# EAGLE schematic GD32F470 (EAGLE 9.6.2)
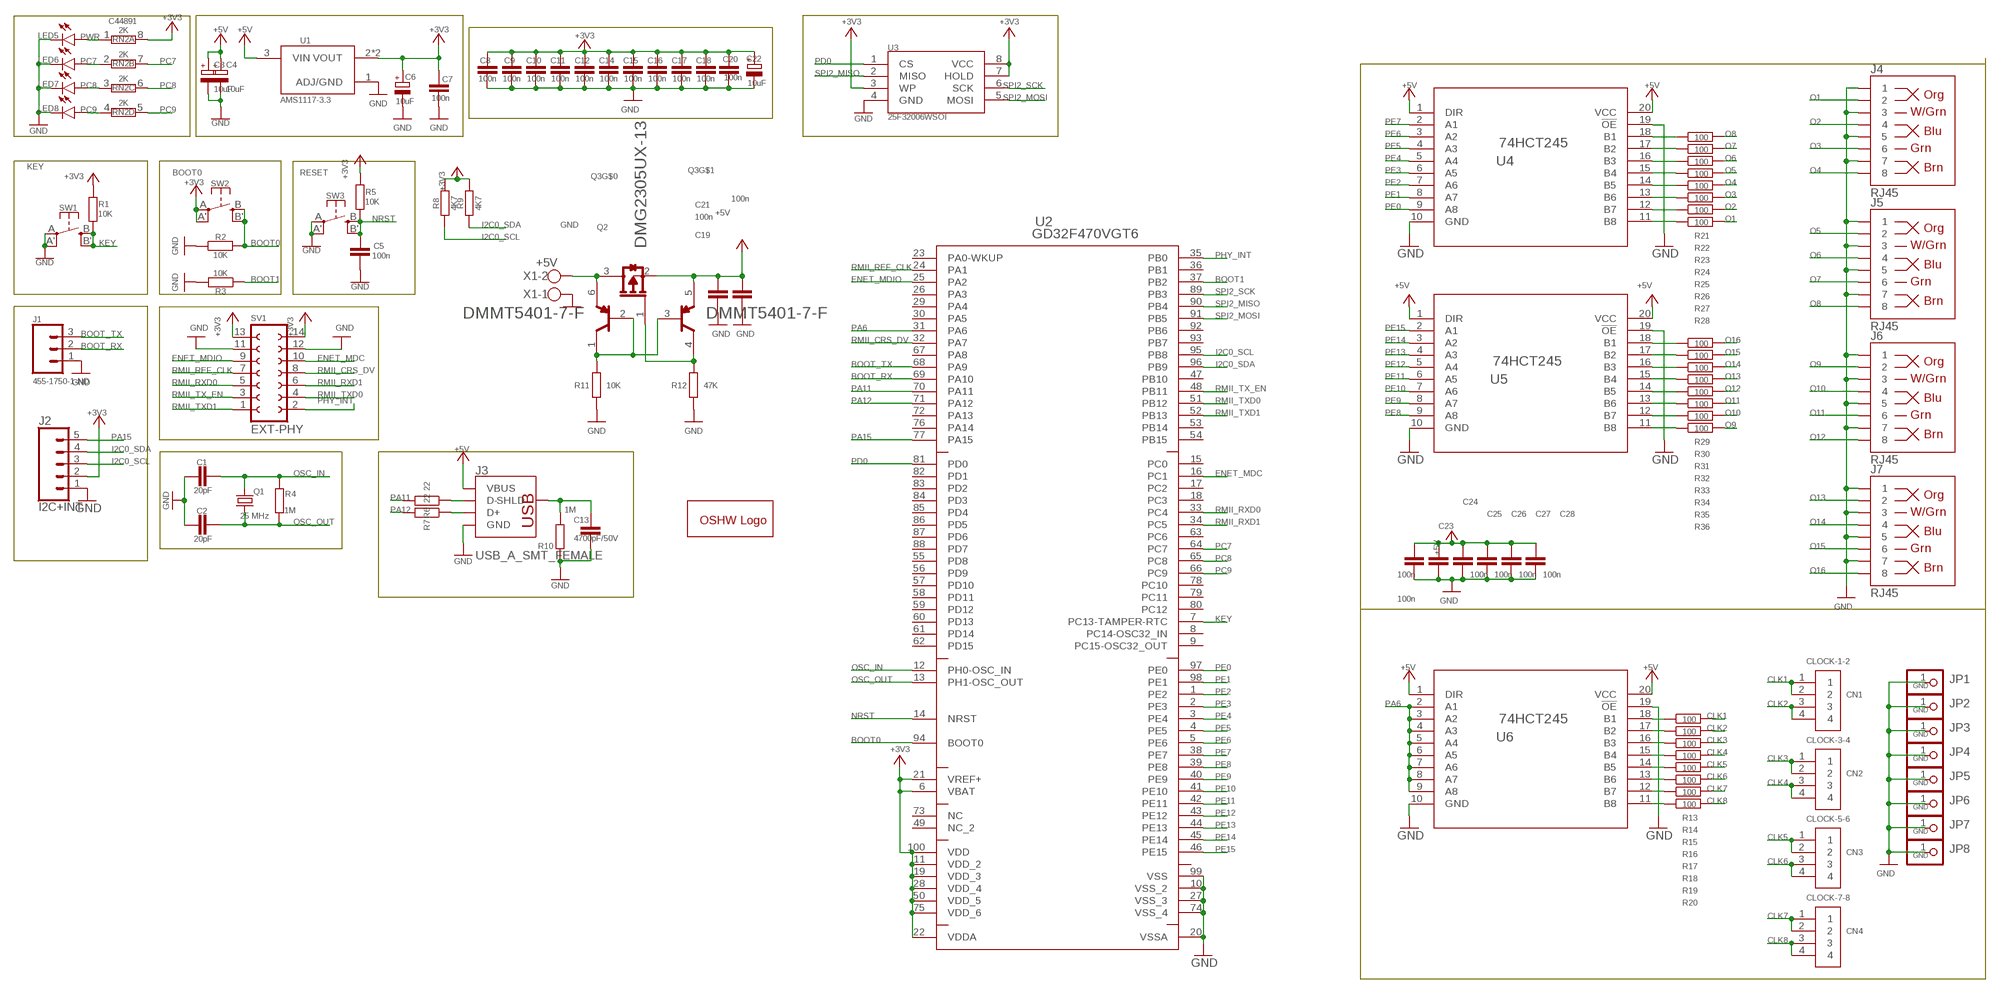
[diagram p0: schematic, sheet 1]

## Parts
C1  20pF  C-EUC0603  [C0603]
C2  20pF  C-EUC0603  [C0603]
C3  10uF  CPOL-EUA/3216-18R  [A/3216-18R]
C4  10uF  CPOL-EUA/3216-18R  [A/3216-18R]
C5  100n  C-EUC0603  [C0603]
C6  10uF  CPOL-EUA/3216-18R  [A/3216-18R]
C7  100n  C-EUC0603  [C0603]
C8  100n  C-EUC0603  [C0603]
C9  100n  C-EUC0603  [C0603]
C10  100n  C-EUC0603  [C0603]
C11  100n  C-EUC0603  [C0603]
C12  100n  C-EUC0603  [C0603]
C13  4700pF/50V  C-EUC0603  [C0603]
C14  100n  C-EUC0603  [C0603]
C15  100n  C-EUC0603  [C0603]
C16  100n  C-EUC0603  [C0603]
C17  100n  C-EUC0603  [C0603]
C18  100n  C-EUC0603  [C0603]
C19  100n  C-EUC0603  [C0603]
C20  100n  C-EUC0603  [C0603]
C21  100n  C-EUC0603  [C0603]
C22  10uF  CPOL-EUA/3216-18R  [A/3216-18R]
C23  100n  C-EUC0603  [C0603]
C24  100n  C-EUC0603  [C0603]
C25  100n  C-EUC0603  [C0603]
C26  100n  C-EUC0603  [C0603]
C27  100n  C-EUC0603  [C0603]
C28  100n  C-EUC0603  [C0603]
CN1  CLOCK-1-2  1X4-CLEANBIG  [1X04-CLEANBIG]
CN2  CLOCK-3-4  1X4-CLEANBIG  [1X04-CLEANBIG]
CN3  CLOCK-5-6  1X4-CLEANBIG  [1X04-CLEANBIG]
CN4  CLOCK-7-8  1X4-CLEANBIG  [1X04-CLEANBIG]
GOLD_ORB_SM1  OSHWLOGOLOGO5MM  [OSHW_5MM]
J1  455-1750-1-ND  CONN_03  [1X03]
J2  I2C+INT  CONN_05PTH  [1X05]
J3  USB_A_SMT_FEMALE  [USB-A]
J4  RJ45  RJ45-8  [RJ45-8]
J5  RJ45  RJ45-8  [RJ45-8]
J6  RJ45  RJ45-8  [RJ45-8]
J7  RJ45  RJ45-8  [RJ45-8]
JP1  GND  PINHD-1X1CB  [1X01-CLEANBIG]
JP2  GND  PINHD-1X1CB  [1X01-CLEANBIG]
JP3  GND  PINHD-1X1CB  [1X01-CLEANBIG]
JP4  GND  PINHD-1X1CB  [1X01-CLEANBIG]
JP5  GND  PINHD-1X1CB  [1X01-CLEANBIG]
JP6  GND  PINHD-1X1CB  [1X01-CLEANBIG]
JP7  GND  PINHD-1X1CB  [1X01-CLEANBIG]
JP8  GND  PINHD-1X1CB  [1X01-CLEANBIG]
LED5  PWR  LEDCHIP-LED0603  [CHIP-LED0603]
LED6  PC7  LEDCHIP-LED0603  [CHIP-LED0603]
LED7  PC8  LEDCHIP-LED0603  [CHIP-LED0603]
LED8  PC9  LEDCHIP-LED0603  [CHIP-LED0603]
Q1  25 MHz  CSM-7X-DU  [CSM-7X-DU]
Q2  DMG2305UX  DIODES_INC._DMG2305UX-13DIODES_INC._DMG2305UX-13_0_0  [DIODES_INC._DMG2305UX-13_0]
Q3  DMMT5401  DIODES_DMMT5401-7-FDIODES_DMMT5401-7-F_0_0  [DIODES_DMMT5401-7-F_0]
R1  10K  R-EU_R0603  [R0603]
R2  10K  R-EU_R0603  [R0603]
R3  10K  R-EU_R0603  [R0603]
R4  1M  R-EU_R0603  [R0603]
R5  10K  R-EU_R0603  [R0603]
R6  22  R-EU_R0402  [R0402]
R7  22  R-EU_R0402  [R0402]
R8  4K7  R-EU_R0402  [R0402]
R9  4K7  R-EU_R0402  [R0402]
R10  1M  R-EU_R0603  [R0603]
R11  10K  R-EU_R0402  [R0402]
R12  47K  R-EU_R0402  [R0402]
R13  100  R-EU_R0402  [R0402]
R14  100  R-EU_R0402  [R0402]
R15  100  R-EU_R0402  [R0402]
R16  100  R-EU_R0402  [R0402]
R17  100  R-EU_R0402  [R0402]
R18  100  R-EU_R0402  [R0402]
R19  100  R-EU_R0402  [R0402]
R20  100  R-EU_R0402  [R0402]
R21  100  R-EU_R0402  [R0402]
R22  100  R-EU_R0402  [R0402]
R23  100  R-EU_R0402  [R0402]
R24  100  R-EU_R0402  [R0402]
R25  100  R-EU_R0402  [R0402]
R26  100  R-EU_R0402  [R0402]
R27  100  R-EU_R0402  [R0402]
R28  100  R-EU_R0402  [R0402]
R29  100  R-EU_R0402  [R0402]
R30  100  R-EU_R0402  [R0402]
R31  100  R-EU_R0402  [R0402]
R32  100  R-EU_R0402  [R0402]
R33  100  R-EU_R0402  [R0402]
R34  100  R-EU_R0402  [R0402]
R35  100  R-EU_R0402  [R0402]
R36  100  R-EU_R0402  [R0402]
RN2  2K  4R-N0402ARV341  [4X0402ARV341]
SV1  EXT-PHY  FE07-2W  [FE07-2W]
SW1  KEY  SPST_TACT-EVQQ2  [EVQ-Q2]
SW2  BOOT0  SPST_TACT-EVQQ2  [EVQ-Q2]
SW3  RESET  SPST_TACT-EVQQ2  [EVQ-Q2]
U1  AMS1117-3.3  [SOT229P700X180-4N]
U2  GD32F470VGT6  GD32F450VET6  [LQFP100]
U3  25F32006WSOI  SPI_FLASH-X25XXSMD1  [SO08-EIAJ]
U4  74HCT245  SN74HCT245PWR  [PW20]
U5  74HCT245  SN74HCT245PWR  [PW20]
U6  74HCT245  SN74HCT245PWR  [PW20]
X1  +5V  W237-102  [W237-102]

## Nets
+3V3: C6.+ C7.1 C8.1 C9.1 C10.1 C11.1 C12.1 C14.1 C15.1 C16.1 C17.1 C18.1 C20.1 C22.+ J2.2 R1.2 R5.2 R8.2 R9.2 RN2.8 SV1.13 SV1.14 SW2.A'(P1) SW2.A(P) U1.2(VOUT) U1.4(VOUT) U2.6(VBAT) U2.11(VDD_2) U2.19(VDD_3) U2.21(VREF+) U2.22(VDDA) U2.28(VDD_4) U2.50(VDD_5) U2.75(VDD_6) U2.100(VDD) U3.3(WP) U3.7(HOLD) U3.8(VCC)
+5V: C3.+ C4.+ C19.1 C21.1 C23.1 C24.1 C25.1 C26.1 C27.1 C28.1 J3.VBUS Q2.2(S) Q3.5(E2) U1.3(VIN) U4.1(DIR) U4.20(VCC) U5.1(DIR) U5.20(VCC) U6.1(DIR) U6.20(VCC)
BOOT0: R2.2 SW2.B'(S1) SW2.B(S) U2.94(BOOT0)
BOOT1: R3.1 U2.37(PB2)
BOOT_RX: J1.2 U2.69(PA10)
BOOT_TX: J1.3 U2.68(PA9)
CLK1: CN1.1 CN1.2 R13.2
CLK2: CN1.3 CN1.4 R14.2
CLK3: CN2.1 CN2.2 R15.2
CLK4: CN2.3 CN2.4 R16.2
CLK5: CN3.1 CN3.2 R17.2
CLK6: CN3.3 CN3.4 R18.2
CLK7: CN4.1 CN4.2 R19.2
CLK8: CN4.3 CN4.4 R20.2
ENET_MDC: SV1.10 U2.16(PC1)
ENET_MDIO: SV1.9 U2.25(PA2)
GND: C1.1 C2.1 C3.- C4.- C5.2 C6.- C7.2 C8.2 C9.2 C10.2 C11.2 C12.2 C13.2 C14.2 C15.2 C16.2 C17.2 C18.2 C19.2 C20.2 C21.2 C22.- C23.2 C24.2 C25.2 C26.2 C27.2 C28.2 J1.1 J2.1 J3.GND J4.1 J4.3 J4.5 J4.7 J5.1 J5.3 J5.5 J5.7 J6.1 J6.3 J6.5 J6.7 J7.1 J7.3 J7.5 J7.7 JP1.1 JP2.1 JP3.1 JP4.1 JP5.1 JP6.1 JP7.1 JP8.1 LED5.C LED6.C LED7.C LED8.C R2.1 R3.2 R10.1 R11.1 R12.1 SV1.11 SV1.12 SW1.A'(P1) SW1.A(P) SW3.A'(P1) SW3.A(P) U1.1(ADJ/GND) U2.10(VSS_2) U2.20(VSSA) U2.27(VSS_3) U2.74(VSS_4) U2.99(VSS) U3.4(GND) U4.10(GND) U4.19(!OE) U5.10(GND) U5.19(!OE) U6.10(GND) U6.19(!OE) X1.1
I2C0_SCL: J2.3 R8.1 U2.95(PB8)
I2C0_SDA: J2.4 R9.1 U2.96(PB9)
KEY: R1.1 SW1.B'(S1) SW1.B(S) U2.7(PC13-TAMPER-RTC)
N$1: R21.1 U4.18(B1)
N$2: Q3.1(C1) Q3.2(B1) Q3.3(B2) R11.2
N$3: R22.1 U4.17(B2)
N$4: R23.1 U4.16(B3)
N$5: R24.1 U4.15(B4)
N$6: R25.1 U4.14(B5)
N$7: R26.1 U4.13(B6)
N$8: R27.1 U4.12(B7)
N$9: R28.1 U4.11(B8)
N$12: R29.1 U5.18(B1)
N$13: R30.1 U5.17(B2)
N$14: R31.1 U5.16(B3)
N$15: R32.1 U5.15(B4)
N$16: R33.1 U5.14(B5)
N$17: R34.1 U5.13(B6)
N$18: R35.1 U5.12(B7)
N$19: R36.1 U5.11(B8)
N$20: J3.D- R6.1
N$21: LED5.A RN2.1
N$22: LED6.A RN2.2
N$23: LED7.A RN2.3
N$24: LED8.A RN2.4
N$30: Q2.1(G) Q3.4(C2) R12.2
N$31: Q2.3(D) Q3.6(E1) X1.2
N$33: R13.1 U6.18(B1)
N$34: R14.1 U6.17(B2)
N$35: R15.1 U6.16(B3)
N$36: R16.1 U6.15(B4)
N$37: R17.1 U6.14(B5)
N$38: R18.1 U6.13(B6)
N$39: R19.1 U6.12(B7)
N$40: R20.1 U6.11(B8)
N$47: J3.D+ R7.1
NRST: C5.1 R5.1 SW3.B'(S1) SW3.B(S) U2.14(NRST)
O1: J4.2 R28.2
O2: J4.4 R27.2
O3: J4.6 R26.2
O4: J4.8 R25.2
O5: J5.2 R24.2
O6: J5.4 R23.2
O7: J5.6 R22.2
O8: J5.8 R21.2
O9: J6.2 R36.2
O10: J6.4 R35.2
O11: J6.6 R34.2
O12: J6.8 R33.2
O13: J7.2 R32.2
O14: J7.4 R31.2
O15: J7.6 R30.2
O16: J7.8 R29.2
OSC_IN: C1.2 Q1.2 R4.1 U2.12(PH0-OSC_IN)
OSC_OUT: C2.2 Q1.1 R4.2 U2.13(PH1-OSC_OUT)
PA6: U2.31(PA6) U6.2(A1) U6.3(A2) U6.4(A3) U6.5(A4) U6.6(A5) U6.7(A6) U6.8(A7) U6.9(A8)
PA11: R6.2 U2.70(PA11)
PA12: R7.2 U2.71(PA12)
PA15: J2.5 U2.77(PA15)
PC7: RN2.7 U2.64(PC7)
PC8: RN2.6 U2.65(PC8)
PC9: RN2.5 U2.66(PC9)
PD0: U2.81(PD0) U3.1(CS)
PE0: U2.97(PE0) U4.9(A8)
PE1: U2.98(PE1) U4.8(A7)
PE2: U2.1(PE2) U4.7(A6)
PE3: U2.2(PE3) U4.6(A5)
PE4: U2.3(PE4) U4.5(A4)
PE5: U2.4(PE5) U4.4(A3)
PE6: U2.5(PE6) U4.3(A2)
PE7: U2.38(PE7) U4.2(A1)
PE8: U2.39(PE8) U5.9(A8)
PE9: U2.40(PE9) U5.8(A7)
PE10: U2.41(PE10) U5.7(A6)
PE11: U2.42(PE11) U5.6(A5)
PE12: U2.43(PE12) U5.5(A4)
PE13: U2.44(PE13) U5.4(A3)
PE14: U2.45(PE14) U5.3(A2)
PE15: U2.46(PE15) U5.2(A1)
PHY_INT: SV1.2 U2.35(PB0)
RMII_CRS_DV: SV1.8 U2.32(PA7)
RMII_REF_CLK: SV1.7 U2.24(PA1)
RMII_RXD0: SV1.5 U2.33(PC4)
RMII_RXD1: SV1.6 U2.34(PC5)
RMII_TX_EN: SV1.3 U2.48(PB11)
RMII_TXD0: SV1.4 U2.51(PB12)
RMII_TXD1: SV1.1 U2.52(PB13)
SHLD: C13.1 J3.SHLD1(SHLD) J3.SHLD2(SHLD) R10.2
SPI2_MISO: U2.90(PB4) U3.2(MISO)
SPI2_MOSI: U2.91(PB5) U3.5(MOSI)
SPI2_SCK: U2.89(PB3) U3.6(SCK)
Unconnected: U2.8(PC14-OSC32_IN) U2.9(PC15-OSC32_OUT) U2.15(PC0) U2.17(PC2) U2.18(PC3) U2.23(PA0-WKUP) U2.26(PA3) U2.29(PA4) U2.30(PA5) U2.36(PB1) U2.47(PB10) U2.49(NC_2) U2.53(PB14) U2.54(PB15) U2.55(PD8) U2.56(PD9) U2.57(PD10) U2.58(PD11) U2.59(PD12) U2.60(PD13) U2.61(PD14) U2.62(PD15) U2.63(PC6) U2.67(PA8) U2.72(PA13) U2.73(NC) U2.76(PA14) U2.78(PC10) U2.79(PC11) U2.80(PC12) U2.82(PD1) U2.83(PD2) U2.84(PD3) U2.85(PD4) U2.86(PD5) U2.87(PD6) U2.88(PD7) U2.92(PB6) U2.93(PB7)

## Library data of the parts
C1 C2 = rcl:C-EU: CAPACITOR, European symbol; JLCPCB: C38523; SPICEPREFIX: C
C3 C4 C6 C22 = rcl:CPOL-EU: POLARIZED CAPACITOR, European symbol; JLCPCB: C7171; SPICEPREFIX: C
C5 C7-C12 C14-C18 C20 C23-C28 = rcl:C-EU: CAPACITOR, European symbol; JLCPCB: C14663; SPICEPREFIX: C
C13 C19 C21 = rcl:C-EU: CAPACITOR, European symbol; SPICEPREFIX: C
CN1-CN4 = adafruit:1X4: 4-pin connector
GOLD_ORB_SM1 = oshw:OSHWLOGO: The OSHW logo for PCB layout
J1 = SparkFun-Connectors:CONN_03: Multi connection point. Often used as Generic Header-pin footprint for 0.1 inch spaced/style header connections On any of the 0.1 inch spaced packages, you can populate with these: Break Away Headers - Straight <https://www.sparkfun.com/products/116> (PRT-00116) Break Away Male Headers - Right Angle <https://www.sparkfun.com/products/553> (PRT-00553) Female Headers <https://www.sparkfun.com/products/115> (PRT-00115) Break Away Headers - Machine Pin <https://www.sparkfun.com/products/117> (PRT-00117) Break Away Female Headers - Swiss Machine Pin <https://www.sparkfun.com/products/743> (PRT-00743) Stackable Header - 3 Pin (Female, 0.1") <https://www.sparkfun.com/products/13875> (PRT-13875) For SCREWTERMINALS and SPRING TERMINALS visit here: Screw Terimnals on SparkFun.com <https://www.sparkfun.com/search/results?term=Screw+Terminals> (5mm/3.5mm/2.54mm spacing) This device is also useful as a general connection point to wire up your design to another part of your project. Our various solder wires solder well into these plated through hole pads. Hook-Up Wire - Assortment (Stranded, 22 AWG) <https://www.sparkfun.com/products/11375> (PRT-11375) Hook-Up Wire - Assortment (Solid Core, 22 AWG) <https://www.sparkfun.com/products/11367> (PRT-11367) View the entire wire category on our website here <https://www.sparkfun.com/categories/141> Special notes: Molex polarized connector foot print use with SKU : PRT-08232 with associated crimp pins and housings.; PROD_ID: XXX-00000
J2 = SparkFun-Connectors:CONN_05: Multi connection point. Often used as Generic Header-pin footprint for 0.1 inch spaced/style header connections On any of the 0.1 inch spaced packages, you can populate with these: Break Away Headers - Straight <https://www.sparkfun.com/products/116> (PRT-00116) Break Away Male Headers - Right Angle <https://www.sparkfun.com/products/553> (PRT-00553) Female Headers <https://www.sparkfun.com/products/115> (PRT-00115) Break Away Headers - Machine Pin <https://www.sparkfun.com/products/117> (PRT-00117) Break Away Female Headers - Swiss Machine Pin <https://www.sparkfun.com/products/743> (PRT-00743) For SCREWTERMINALS and SPRING TERMINALS visit here: Screw Terimnals on SparkFun.com <https://www.sparkfun.com/search/results?term=Screw+Terminals> (5mm/3.5mm/2.54mm spacing) This device is also useful as a general connection point to wire up your design to another part of your project. Our various solder wires solder well into these plated through hole pads. Hook-Up Wire - Assortment (Stranded, 22 AWG) <https://www.sparkfun.com/products/11375> (PRT-11375) Hook-Up Wire - Assortment (Solid Core, 22 AWG) <https://www.sparkfun.com/products/11367> (PRT-11367) View the entire wire category on our website here <https://www.sparkfun.com/categories/141> Special notes: Molex polarized connector foot print use with SKU : PRT-08231 with associated crimp pins and housings. 1MM SMD Version SKU: PRT-10208
J3 = GD32F:USB_A; JLCPCB: C668591
J4-J7 = SparkFun-Connectors:RJ45-8: RJ45 Jack - 8 pin Simple RJ45, 8-pin connection. Commonly used for Cat5, Cat5e, and Cat6 Ethernet cables. Here is the connector we sell at SparkFun: RJ45 8-Pin Connector <https://www.sparkfun.com/products/643> (PRT-00643) Datasheet <https://cdn.sparkfun.com/datasheets/Prototyping/04908.pdf> It is used on this SparkFun product: SparkFun RJ45 Breakout <https://www.sparkfun.com/products/716> (BOB-00716) Note, you may also be interested in the "MAGJACK" version of this. It is basically a RJ45 connector, but also has some status LEDs built into the connector housing. You can check that out in this library at the device named "MAGJACK.dev" and see these products online: RJ45 Ethernet MagJack-Compatible <https://www.sparkfun.com/products/8534> (PRT-08534) SparkFun RJ45 MagJack Breakout <https://www.sparkfun.com/products/13021> (BOB-13021); PROD_ID: CONN-08506; SF_ID: PRT-00643
JP1-JP8 = adafruit:PINHD-1X1: Pin header 1x1 for 0.1" spacing With round pins
LED5-LED8 = led:LED: LED OSRAM: - CHIPLED LG R971, LG N971, LY N971, LG Q971, LY Q971, LO R971, LY R971 LH N974, LH R974 LS Q976, LO Q976, LY Q976 LO Q996 - Hyper CHIPLED LW Q18S LB Q993, LB Q99A, LB R99A - SideLED LS A670, LO A670, LY A670, LG A670, LP A670 LB A673, LV A673, LT A673, LW A673 LH A674 LY A675 LS A676, LA A676, LO A676, LY A676, LW A676 LS A679, LY A679, LG A679 - Hyper Micro SIDELED® LS Y876, LA Y876, LO Y876, LY Y876 LT Y87S - SmartLED LW L88C, LW L88S LB L89C, LB L89S, LG L890 LS L89K, LO L89K, LY L89K LS L896, LA L896, LO L896, LY L896 - TOPLED LS T670, LO T670, LY T670, LG T670, LP T670 LSG T670, LSP T670, LSY T670, LOP T670, LYG T670 LG T671, LOG T671, LSG T671 LB T673, LV T673, LT T673, LW T673 LH T674 LS T676, LA T676, LO T676, LY T676, LB T676, LH T676, LSB T676, LW T676 LB T67C, LV T67C, LT T67C, LS T67K, LO T67K, LY T67K, LW E67C LS E67B, LA E67B, LO E67B, LY E67B, LB E67C, LV E67C, LT E67C LW T67C LS T679, LY T679, LG T679 LS T770, LO T770, LY T770, LG T770, LP T770 LB T773, LV T773, LT T773, LW T773 LH T774 LS E675, LA E675, LY E675, LS T675 LS T776, LA T776, LO T776, LY T776, LB T776 LHGB T686 LT T68C, LB T68C - Hyper Mini TOPLED® LB M676 - Mini TOPLED Santana® LG M470 LS M47K, LO M47K, LY M47K Source: http://www.osram.convergy.de LUXEON: - LUMILED® LXK2-PW12-R00, LXK2-PW12-S00, LXK2-PW14-U00, LXK2-PW14-V00 LXK2-PM12-R00, LXK2-PM12-S00, LXK2-PM14-U00 LXK2-PE12-Q00, LXK2-PE12-R00, LXK2-PE12-S00, LXK2-PE14-T00, LXK2-PE14-U00 LXK2-PB12-K00, LXK2-PB12-L00, LXK2-PB12-M00, LXK2-PB14-N00, LXK2-PB14-P00, LXK2-PB14-Q00 LXK2-PR12-L00, LXK2-PR12-M00, LXK2-PR14-Q00, LXK2-PR14-R00 LXK2-PD12-Q00, LXK2-PD12-R00, LXK2-PD12-S00 LXK2-PH12-R00, LXK2-PH12-S00 LXK2-PL12-P00, LXK2-PL12-Q00, LXK2-PL12-R00 Source: www.luxeon.com KINGBRIGHT: KA-3528ASYC Source: www.kingbright.com
Q1 = crystal:CSM-7X-DU: SMD CRYSTAL Source: www.ecsxtal.com .. Crystal 3.6864MHz CSM_7X_DU.PDF; JLCPCB: C14872; OC_FARNELL: unknown; OC_NEWARK: unknown
Q2 = Diodes Inc. - DMG2305UX-13:DIODES_INC._DMG2305UX-13: P-Channel 20V 4.2A (Ta) 1.4W (Ta) Surface Mount SOT-23; AUTOMOTIVE: No; CENTROID_NOT_SPECIFIED: No; CONTINUOUS_DRAIN_CURRENT: -4.2A; DATASHEET: https://www.diodes.com/assets/Datasheets/DMG2305UX.pdf; DEPLETION_MODE: False; DEVICE_CLASS_L1: Discrete Semiconductors; DEVICE_CLASS_L2: Transistors; DEVICE_CLASS_L3: MOSFETs; DIGIKEY_DESCRIPTION: TRANS MOSFET P-CH 20V 4.2A SOT23; DIGIKEY_PART_NUMBER: DMG2305UX-13DICT-ND; DRAIN_TO_SOURCE_BREAKDOWN_VOLTAGE: -20V; DRAIN_TO_SOURCE_RESISTANCE: 40mΩ; DRAIN_TO_SOURCE_VOLTAGE: -20V; FOOTPRINT_PARAMETERS_1: {"fp_type":"SOT23","params":{"N":{"default":"3","long name":"Number of leads","type":"multichoice","short name":"N"},"A":{"nom":1024999,"long name":"Height","min":903000,"max":1100000,"short name":"A","type":"measurement"},"A1":{"nom":50000,"long name":"Package clearance","min":13000,"max":100000,"short name":"A1","type":"measurement"},"A2":{"nom":975000,"long name":"Package height","min":890000,"max":1000000,"short name":"A2","type":"measurement"},"D":{"nom":2900000,"long name":"Package length","min":2800000,"max":3000000,"short name":"D","type":"measurement"},"E":{"nom":2400000,"long name":"Width /w leads","min":2300000,"max":2500000,"short name":"E","type":"measurement"},"E1":{"nom":1300000,"long name":"Package width","min":1200000,"max":1400000,"short name":"E1","type":"measurement"},"B":{"nom":400000,"long name":"Lead width","min":370000,"max":510000,"short name":"B","type":"measurement"},"C":{"nom":110000,"long name":"Lead thickness","min":85000,"max":150000,"short name":"C","type":"measurement"},"L":{"nom":400000,"long name":"Lead foot length","min":250000,"max":550000,"short name":"L","type":"measurement"},"e":{"nom":915000,"long name":"Lead pitch","min":null,"max":null,"short name":"e","type":"measurement"},"PHI":{"nom":false,"long name":"Lead angle","min":0,"max":8000000,"short name":"PHI","type":"measurement"},"offset x":{"nom":0,"long name":"X Center offset","min":null,"max":null,"short name":"offset x","type":"measurement"},"offset y":{"nom":0,"long name":"Y Center offset","min":null,"max":null,"short name":"offset y","type":"measurement"},"LS":{"default":"Rounded rectangle","long name":"Land shape","type":"multichoice","short name":"LS"},"LS1":{"default":"Rectangle","long name":"Land shape (Pin 1)","type":"multichoice","short name":"LS1"},"solder toe":{"nom":550000,"long name":"Solder fillet (toe)","min":null,"max":null,"short name":"solder toe","type":"fixedmeasurement"},"solder heel":{"nom":450000,"long name":"Solder fillet (heel)","min":null,"max":null,"short name":"solder heel","type":"fixedmeasurement"},"solder side":{"nom":50000,"long name":"Solder fillet (side)","min":null,"max":null,"short name":"solder side","type":"fixedmeasurement"},"courtyard":{"nom":500000,"long name":"Courtyard","min":null,"max":null,"short name":"courtyard","type":"fixedmeasurement"},"SF":{"default":"A","long name":"Packing level","type":"multichoiceparent","short name":"SF","help":"http://support.upverter.com/customer/portal/articles/978783-what-is-a-footprint-packing-level","children":["solder toe","solder heel","solder side","courtyard"]}}}; FOOTPRINT_PARAMETERS_2: {"fp_type":"SOT23","params":{"N":{"default":"3","long name":"Number of leads","type":"multichoice","short name":"N"},"A":{"nom":1024999,"long name":"Height","min":903000,"max":1100000,"short name":"A","type":"measurement"},"A1":{"nom":50000,"long name":"Package clearance","min":13000,"max":100000,"short name":"A1","type":"measurement"},"A2":{"nom":975000,"long name":"Package height","min":890000,"max":1000000,"short name":"A2","type":"measurement"},"D":{"nom":2900000,"long name":"Package length","min":2800000,"max":3000000,"short name":"D","type":"measurement"},"E":{"nom":2400000,"long name":"Width /w leads","min":2300000,"max":2500000,"short name":"E","type":"measurement"},"E1":{"nom":1300000,"long name":"Package width","min":1200000,"max":1400000,"short name":"E1","type":"measurement"},"B":{"nom":400000,"long name":"Lead width","min":370000,"max":510000,"short name":"B","type":"measurement"},"C":{"nom":110000,"long name":"Lead thickness","min":85000,"max":150000,"short name":"C","type":"measurement"},"L":{"nom":400000,"long name":"Lead foot length","min":250000,"max":550000,"short name":"L","type":"measurement"},"e":{"nom":915000,"long name":"Lead pitch","min":null,"max":null,"short name":"e","type":"measurement"},"PHI":{"nom":false,"long name":"Lead angle","min":0,"max":8000000,"short name":"PHI","type":"measurement"},"offset x":{"nom":0,"long name":"X Center offset","min":null,"max":null,"short name":"offset x","type":"measurement"},"offset y":{"nom":0,"long name":"Y Center offset","min":null,"max":null,"short name":"offset y","type":"measurement"},"LS":{"default":"Rounded rectangle","long name":"Land shape","type":"multichoice","short name":"LS"},"LS1":{"default":"Rectangle","long name":"Land shape (Pin 1)","type":"multichoice","short name":"LS1"},"solder toe":{"nom":350000,"long name":"Solder fillet (toe)","min":null,"max":null,"short name":"solder toe","type":"fixedmeasurement"},"solder heel":{"nom":350000,"long name":"Solder fillet (heel)","min":null,"max":null,"short name":"solder heel","type":"fixedmeasurement"},"solder side":{"nom":30000,"long name":"Solder fillet (side)","min":null,"max":null,"short name":"solder side","type":"fixedmeasurement"},"courtyard":{"nom":250000,"long name":"Courtyard","min":null,"max":null,"short name":"courtyard","type":"fixedmeasurement"},"SF":{"default":"B","long name":"Packing level","type":"multichoiceparent","short name":"SF","help":"http://support.upverter.com/customer/portal/articles/978783-what-is-a-footprint-packing-level","children":["solder toe","solder heel","solder side","courtyard"]}}}; FOOTPRINT_PARAMETERS_3: {"fp_type":"SOT23","params":{"N":{"default":"3","long name":"Number of leads","type":"multichoice","short name":"N"},"A":{"nom":1024999,"long name":"Height","min":903000,"max":1100000,"short name":"A","type":"measurement"},"A1":{"nom":50000,"long name":"Package clearance","min":13000,"max":100000,"short name":"A1","type":"measurement"},"A2":{"nom":975000,"long name":"Package height","min":890000,"max":1000000,"short name":"A2","type":"measurement"},"D":{"nom":2900000,"long name":"Package length","min":2800000,"max":3000000,"short name":"D","type":"measurement"},"E":{"nom":2400000,"long name":"Width /w leads","min":2300000,"max":2500000,"short name":"E","type":"measurement"},"E1":{"nom":1300000,"long name":"Package width","min":1200000,"max":1400000,"short name":"E1","type":"measurement"},"B":{"nom":400000,"long name":"Lead width","min":370000,"max":510000,"short name":"B","type":"measurement"},"C":{"nom":110000,"long name":"Lead thickness","min":85000,"max":150000,"short name":"C","type":"measurement"},"L":{"nom":400000,"long name":"Lead foot length","min":250000,"max":550000,"short name":"L","type":"measurement"},"e":{"nom":915000,"long name":"Lead pitch","min":null,"max":null,"short name":"e","type":"measurement"},"PHI":{"nom":false,"long name":"Lead angle","min":0,"max":8000000,"short name":"PHI","type":"measurement"},"offset x":{"nom":0,"long name":"X Center offset","min":null,"max":null,"short name":"offset x","type":"measurement"},"offset y":{"nom":0,"long name":"Y Center offset","min":null,"max":null,"short name":"offset y","type":"measurement"},"LS":{"default":"Rounded rectangle","long name":"Land shape","type":"multichoice","short name":"LS"},"LS1":{"default":"Rectangle","long name":"Land shape (Pin 1)","type":"multichoice","short name":"LS1"},"solder toe":{"nom":150000,"long name":"Solder fillet (toe)","min":null,"max":null,"short name":"solder toe","type":"fixedmeasurement"},"solder heel":{"nom":250000,"long name":"Solder fillet (heel)","min":null,"max":null,"short name":"solder heel","type":"fixedmeasurement"},"solder side":{"nom":10000,"long name":"Solder fillet (side)","min":null,"max":null,"short name":"solder side","type":"fixedmeasurement"},"courtyard":{"nom":100000,"long name":"Courtyard","min":null,"max":null,"short name":"courtyard","type":"fixedmeasurement"},"SF":{"default":"C","long name":"Packing level","type":"multichoiceparent","short name":"SF","help":"http://support.upverter.com/customer/portal/articles/978783-what-is-a-footprint-packing-level","children":["solder toe","solder heel","solder side","courtyard"]}}}; FOOTPRINT_URL: https://www.diodes.com/assets/Package-Files/SOT23.pdf; FOOTPRINT_VARIANT_NAME_0: Recommended_Land_Pattern; FOOTPRINT_VARIANT_NAME_1: IPC_A; FOOTPRINT_VARIANT_NAME_2: IPC_B; FOOTPRINT_VARIANT_NAME_3: IPC_C; GATE_CHARGE_AT_VGS: 10.2nC @ -4.5V; GATE_TO_SOURCE_VOLTAGE: 8V; HEIGHT: 1.1mm; INPUT_CAPACITACE_AT_VDS: 808pF @ -15V; IPC_LAND_PATTERN_NAME: SOT92P240X102-3; LEAD_FREE: Yes; MAX_JUNCTION_TEMP: +150°C; MF: Diodes Inc.; MFG_PACKAGE_IDENT: SOT23; MFG_PACKAGE_IDENT_DATE: 01/2017; MFG_PACKAGE_IDENT_REV: 0; MOUSER_DESCRIPTION: MOSFET P-Ch ENH FET -20V 52mOhm -5.0V; MOUSER_PART_NUMBER: 621-DMG2305UX-13; MPN: DMG2305UX-13; NUMBER_OF_CHANNELS: 1; NUMBER_OF_P_CHANNELS: 1; PACKAGE: SOT23; POWER_DISSIPATION: 1.4W; PREFIX: Q; PULSE_DRAIN_CURRENT: -15A; ROHS: Yes; RTHJA_MAX: 90°C/W; STANDOFF_HEIGHT: 0.013mm; TEMPERATURE_RANGE_HIGH: +150°C; TEMPERATURE_RANGE_LOW: -55°C; THRESHOLD_VGS_MAX: -0.9V; THRESHOLD_VGS_MIN: -0.5V; TURN_OFF_DELAY_TIME: 79.3ns; TURN_ON_DELAY_TIME: 10.8ns; VERIFICATION_VERSION: 0.0.0.3
Q3 = Diodes - DMMT5401-7-F:DIODES_DMMT5401-7-F: Bipolar (BJT) Transistor Array 2 PNP (Dual) Matched Pair 150V 200mA 300MHz 300mW Surface Mount SOT-26; AUTOMOTIVE: Yes; AUTOMOTIVE_GRADE: Grade 0; CENTROID_NOT_SPECIFIED: No; CIIVA_IDS: 854262; COLLECTOR_BASE_VOLTAGE: -160V; COLLECTOR_EMITTER_BREAKDOWN_VOLTAGE: -150V; COLLECTOR_EMITTER_SATURATION_VOLTAGE: -0.5V; COLLECTOR_EMITTER_VOLTAGE: -150V; DATASHEET: https://www.diodes.com/assets/Datasheets/ds30437.pdf; DEVICE_CLASS_L1: Discrete Semiconductors; DEVICE_CLASS_L2: Transistors; DEVICE_CLASS_L3: BJTs; DIGIKEY_DESCRIPTION: TRANS 2PNP 150V 0.2A SOT26; DIGIKEY_PART_NUMBER: DMMT5401-FDICT-ND; EMITTER_BASE_VOLTAGE: -5V; FOOTPRINT_PARAMETERS_1: {"fp_type":"SOT23","params":{"N":{"default":"6","long name":"Number of leads","type":"multichoice","short name":"N"},"A":{"nom":1150000,"long name":"Height","min":1012999,"max":1400000,"short name":"A","type":"measurement"},"A1":{"nom":50000,"long name":"Package clearance","min":13000,"max":100000,"short name":"A1","type":"measurement"},"A2":{"nom":1100000,"long name":"Package height","min":1000000,"max":1300000,"short name":"A2","type":"measurement"},"D":{"nom":3000000,"long name":"Package length","min":2900000,"max":3100000,"short name":"D","type":"measurement"},"E":{"nom":2800000,"long name":"Width /w leads","min":2700000,"max":3000000,"short name":"E","type":"measurement"},"E1":{"nom":1600000,"long name":"Package width","min":1500000,"max":1700000,"short name":"E1","type":"measurement"},"B":{"nom":380000,"long name":"Lead width","min":350000,"max":500000,"short name":"B","type":"measurement"},"C":{"nom":150000,"long name":"Lead thickness","min":100000,"max":200000,"short name":"C","type":"measurement"},"L":{"nom":400000,"long name":"Lead foot length","min":350000,"max":550000,"short name":"L","type":"measurement"},"e":{"nom":950000,"long name":"Lead pitch","min":null,"max":null,"short name":"e","type":"measurement"},"PHI":{"nom":false,"long name":"Lead angle","min":0,"max":8000000,"short name":"PHI","type":"measurement"},"offset x":{"nom":0,"long name":"X Center offset","min":null,"max":null,"short name":"offset x","type":"measurement"},"offset y":{"nom":0,"long name":"Y Center offset","min":null,"max":null,"short name":"offset y","type":"measurement"},"LS":{"default":"Rounded rectangle","long name":"Land shape","type":"multichoice","short name":"LS"},"LS1":{"default":"Rectangle","long name":"Land shape (Pin 1)","type":"multichoice","short name":"LS1"},"solder toe":{"nom":550000,"long name":"Solder fillet (toe)","min":null,"max":null,"short name":"solder toe","type":"fixedmeasurement"},"solder heel":{"nom":450000,"long name":"Solder fillet (heel)","min":null,"max":null,"short name":"solder heel","type":"fixedmeasurement"},"solder side":{"nom":50000,"long name":"Solder fillet (side)","min":null,"max":null,"short name":"solder side","type":"fixedmeasurement"},"courtyard":{"nom":500000,"long name":"Courtyard","min":null,"max":null,"short name":"courtyard","type":"fixedmeasurement"},"SF":{"default":"A","long name":"Packing level","type":"multichoiceparent","short name":"SF","help":"http://support.upverter.com/customer/portal/articles/978783-what-is-a-footprint-packing-level","children":["solder toe","solder heel","solder side","courtyard"]}}}; FOOTPRINT_PARAMETERS_2: {"fp_type":"SOT23","params":{"N":{"default":"6","long name":"Number of leads","type":"multichoice","short name":"N"},"A":{"nom":1150000,"long name":"Height","min":1012999,"max":1400000,"short name":"A","type":"measurement"},"A1":{"nom":50000,"long name":"Package clearance","min":13000,"max":100000,"short name":"A1","type":"measurement"},"A2":{"nom":1100000,"long name":"Package height","min":1000000,"max":1300000,"short name":"A2","type":"measurement"},"D":{"nom":3000000,"long name":"Package length","min":2900000,"max":3100000,"short name":"D","type":"measurement"},"E":{"nom":2800000,"long name":"Width /w leads","min":2700000,"max":3000000,"short name":"E","type":"measurement"},"E1":{"nom":1600000,"long name":"Package width","min":1500000,"max":1700000,"short name":"E1","type":"measurement"},"B":{"nom":380000,"long name":"Lead width","min":350000,"max":500000,"short name":"B","type":"measurement"},"C":{"nom":150000,"long name":"Lead thickness","min":100000,"max":200000,"short name":"C","type":"measurement"},"L":{"nom":400000,"long name":"Lead foot length","min":350000,"max":550000,"short name":"L","type":"measurement"},"e":{"nom":950000,"long name":"Lead pitch","min":null,"max":null,"short name":"e","type":"measurement"},"PHI":{"nom":false,"long name":"Lead angle","min":0,"max":8000000,"short name":"PHI","type":"measurement"},"offset x":{"nom":0,"long name":"X Center offset","min":null,"max":null,"short name":"offset x","type":"measurement"},"offset y":{"nom":0,"long name":"Y Center offset","min":null,"max":null,"short name":"offset y","type":"measurement"},"LS":{"default":"Rounded rectangle","long name":"Land shape","type":"multichoice","short name":"LS"},"LS1":{"default":"Rectangle","long name":"Land shape (Pin 1)","type":"multichoice","short name":"LS1"},"solder toe":{"nom":350000,"long name":"Solder fillet (toe)","min":null,"max":null,"short name":"solder toe","type":"fixedmeasurement"},"solder heel":{"nom":350000,"long name":"Solder fillet (heel)","min":null,"max":null,"short name":"solder heel","type":"fixedmeasurement"},"solder side":{"nom":30000,"long name":"Solder fillet (side)","min":null,"max":null,"short name":"solder side","type":"fixedmeasurement"},"courtyard":{"nom":250000,"long name":"Courtyard","min":null,"max":null,"short name":"courtyard","type":"fixedmeasurement"},"SF":{"default":"B","long name":"Packing level","type":"multichoiceparent","short name":"SF","help":"http://support.upverter.com/customer/portal/articles/978783-what-is-a-footprint-packing-level","children":["solder toe","solder heel","solder side","courtyard"]}}}; FOOTPRINT_PARAMETERS_3: {"fp_type":"SOT23","params":{"N":{"default":"6","long name":"Number of leads","type":"multichoice","short name":"N"},"A":{"nom":1150000,"long name":"Height","min":1012999,"max":1400000,"short name":"A","type":"measurement"},"A1":{"nom":50000,"long name":"Package clearance","min":13000,"max":100000,"short name":"A1","type":"measurement"},"A2":{"nom":1100000,"long name":"Package height","min":1000000,"max":1300000,"short name":"A2","type":"measurement"},"D":{"nom":3000000,"long name":"Package length","min":2900000,"max":3100000,"short name":"D","type":"measurement"},"E":{"nom":2800000,"long name":"Width /w leads","min":2700000,"max":3000000,"short name":"E","type":"measurement"},"E1":{"nom":1600000,"long name":"Package width","min":1500000,"max":1700000,"short name":"E1","type":"measurement"},"B":{"nom":380000,"long name":"Lead width","min":350000,"max":500000,"short name":"B","type":"measurement"},"C":{"nom":150000,"long name":"Lead thickness","min":100000,"max":200000,"short name":"C","type":"measurement"},"L":{"nom":400000,"long name":"Lead foot length","min":350000,"max":550000,"short name":"L","type":"measurement"},"e":{"nom":950000,"long name":"Lead pitch","min":null,"max":null,"short name":"e","type":"measurement"},"PHI":{"nom":false,"long name":"Lead angle","min":0,"max":8000000,"short name":"PHI","type":"measurement"},"offset x":{"nom":0,"long name":"X Center offset","min":null,"max":null,"short name":"offset x","type":"measurement"},"offset y":{"nom":0,"long name":"Y Center offset","min":null,"max":null,"short name":"offset y","type":"measurement"},"LS":{"default":"Rounded rectangle","long name":"Land shape","type":"multichoice","short name":"LS"},"LS1":{"default":"Rectangle","long name":"Land shape (Pin 1)","type":"multichoice","short name":"LS1"},"solder toe":{"nom":150000,"long name":"Solder fillet (toe)","min":null,"max":null,"short name":"solder toe","type":"fixedmeasurement"},"solder heel":{"nom":250000,"long name":"Solder fillet (heel)","min":null,"max":null,"short name":"solder heel","type":"fixedmeasurement"},"solder side":{"nom":10000,"long name":"Solder fillet (side)","min":null,"max":null,"short name":"solder side","type":"fixedmeasurement"},"courtyard":{"nom":100000,"long name":"Courtyard","min":null,"max":null,"short name":"courtyard","type":"fixedmeasurement"},"SF":{"default":"C","long name":"Packing level","type":"multichoiceparent","short name":"SF","help":"http://support.upverter.com/customer/portal/articles/978783-what-is-a-footprint-packing-level","children":["solder toe","solder heel","solder side","courtyard"]}}}; FOOTPRINT_URL: https://www.diodes.com/assets/Package-Files/SOT26-SC74R.pdf; FOOTPRINT_VARIANT_NAME_0: Recommended_Land_Pattern; FOOTPRINT_VARIANT_NAME_1: IPC_A; FOOTPRINT_VARIANT_NAME_2: IPC_B; FOOTPRINT_VARIANT_NAME_3: IPC_C; GAIN_BANDWIDTH_PRODUCT: 100MHz; HEIGHT: 1.4mm; HFE_MAX: 240; HFE_MIN: 60; HFE_SS_MAX: 260; HFE_SS_MIN: 40; HFE_SS_TESTIC: -1mA; HFE_SS_TESTVCE: -10V; HFE_TESTIC: -10mA; HFE_TESTVCE: -5V; IMPORTED_FROM: vault; IMPORT_TS: 1521857859; LEAD_FREE: Yes; MAX_COLLECTOR_CURRENT: -200mA; MAX_JUNCTION_TEMP: +150°C; MF: Diodes; MFG_PACKAGE_IDENT: SOT26 (SC74R); MFG_PACKAGE_IDENT_COMPONENT_ID: 5f0f242ef940d63b; MFG_PACKAGE_IDENT_DATE: 03/2017; MFG_PACKAGE_IDENT_REV: 0; MOUSER_DESCRIPTION: Bipolar Transistors - BJT MATCHED PNP SM SIGNAL TRANS; MOUSER_PART_NUMBER: 621-DMMT5401-7-F; MPN: DMMT5401-7-F; NUMBER_OF_ELEMENTS: 2; NUMBER_OF_PNP: 2; PACKAGE: SOT-26-6; POWER_DISSIPATION: 300mW; PREFIX: Q; RELEASE_DATE: 1475030218; RESISTANCE: 56.2 kohm; ROHS: Yes; RTHJA_MAX: 417°C/W; STANDOFF_HEIGHT: 0.013mm; TEMPERATURE_RANGE_HIGH: +150°C; TEMPERATURE_RANGE_LOW: -55°C; VAULT_GUID: AAD9F767-3884-4A64-86E0-FF641185CA98; VERIFICATION_VERSION: 0.0.0.3
R1-R3 R5 = rcl:R-EU_: RESISTOR, European symbol; JLCPCB: C25804; SPICEPREFIX: R
R4 = rcl:R-EU_: RESISTOR, European symbol; JLCPCB: C22935; SPICEPREFIX: R
R6 R7 R11-R36 = rcl:R-EU_: RESISTOR, European symbol; SPICEPREFIX: R
R8 R9 = rcl:R-EU_: RESISTOR, European symbol; JLCPCB: C23162; SPICEPREFIX: R
R10 = rcl:R-EU_: RESISTOR, European symbol
RN2 = resistor-dil:4R-N: Array Chip Resistor Source: RS Component / Phycomp; JLCPCB: C44891; OC_FARNELL: unknown; OC_NEWARK: unknown
SV1 = con-lsta:FE07-2W: FEMALE HEADER; OC_FARNELL: unknown; OC_NEWARK: unknown
SW1 SW3 = adafruit:SPST_TACT: SMT 6mm switch, EVQQ2 series http://www.ladyada.net/library/eagle
SW2 = adafruit:SPST_TACT: SMT 6mm switch, EVQQ2 series http://www.ladyada.net/library/eagle; JLCPCB: C221880
U1 = AMS1117-3.3:AMS1117-3.3: Fixed 15V 3.3V 1.3V @ 800mA SOT-223 Dropout Regulators(LDO); DESCRIPTION: Fixed 15V 3.3V 1.3V @ 800mA SOT-223 Dropout Regulators(LDO) RoHS; JLCPCB: C6186; MF: Advanced Monolithic Systems; MP: AMS1117-3.3; PACKAGE: SOT-223
U2 = GD32F450Vx:GD32F450VET6; COPYRIGHT: Copyright (C) 2022 Ultra Librarian. All rights reserved.; MANUFACTURER_PART_NUMBER: GD32F450VET6; MFR_NAME: GigaDevice
U3 = SparkFun-IC-Memory:SPI_FLASH-X25XX: 32M Serial Flash Memory 8pin SPI Flash series x25xx. Works with devices like W25X32 and BR25L32 Datasheet <http://www.macronix.com/Lists/Datasheet/Attachments/5031/MX25L3206E,%203V,%2032Mb,%20v1.5.pdf> SparkFun Products SparkFun Venus GPS Logger <https://www.sparkfun.com/products/10920> (GPS-10920); JLCPCB: C97521; PROD_ID: IC-09109
U4-U6 = SN74HCT245PWR:SN74HCT245PWR; DATASHEET_URL: http://www.ti.com/lit/gpn/SN74HCT245; DESCRIPTION: Octal Bus Transceivers With 3-State Outputs; FAMILY_NAME: STANDARD TRANSCEIVER; GENERIC_PART_NUMBER: SN74HCT245; INDUSTRY_STD_PKG_TYPE: TSSOP; MANUFACTURER: Texas Instruments; MANUFACTURER_PART_NUMBER: SN74HCT245PWR; PACKAGE_DESIGNATOR: PW; PIN_COUNT: 20; VENDOR: Texas Instruments
X1 = con-wago-500:W237-102: WAGO SCREW CLAMP; MPN: 237-102; OC_FARNELL: unknown; OC_NEWARK: 70K9898